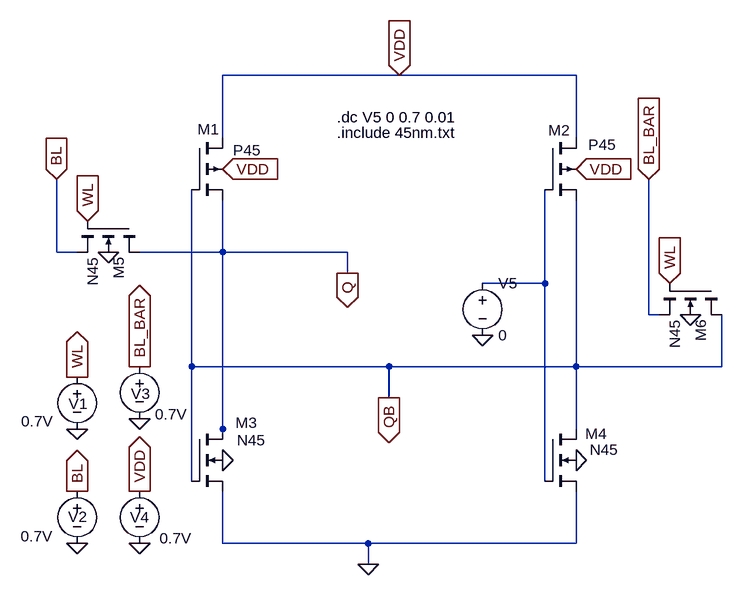
[diagram p0: schematic SNM_Test.asc]
SNM_Test.asc, the LTspice schematic file:
Version 4.1
SHEET 1 2232 956
WIRE 480 -32 208 -32
WIRE 752 -32 480 -32
WIRE 208 64 208 -32
WIRE 752 64 752 -32
WIRE -48 240 -48 128
WIRE -16 240 -48 240
WIRE 208 240 208 160
WIRE 208 240 80 240
WIRE 400 240 208 240
WIRE 400 272 400 240
WIRE 704 288 704 144
WIRE 704 288 608 288
WIRE 864 336 864 128
WIRE 880 336 864 336
WIRE 160 416 160 144
WIRE 464 416 160 416
WIRE 752 416 752 160
WIRE 752 416 464 416
WIRE 976 416 976 336
WIRE 976 416 752 416
WIRE 464 464 464 416
WIRE 208 512 208 240
WIRE 752 512 752 416
WIRE 208 528 208 512
WIRE 160 592 160 416
WIRE 704 592 704 288
WIRE 208 688 208 608
WIRE 432 688 208 688
WIRE 752 688 752 608
WIRE 752 688 432 688
WIRE 432 720 432 688
FLAG -16 512 0
FLAG -16 688 0
FLAG 80 496 0
FLAG 80 688 0
FLAG -16 432 WL
IOPIN -16 432 Out
FLAG -16 608 BL
IOPIN -16 608 Out
FLAG 80 416 BL_BAR
IOPIN 80 416 Out
FLAG 80 608 VDD
IOPIN 80 608 Out
FLAG 928 336 0
FLAG 32 240 0
FLAG 432 720 0
FLAG 0 192 WL
IOPIN 0 192 In
FLAG 480 -32 VDD
IOPIN 480 -32 In
FLAG 864 128 BL_BAR
IOPIN 864 128 In
FLAG -48 128 BL
IOPIN -48 128 In
FLAG 400 272 Q
IOPIN 400 272 Out
FLAG 464 464 QB
IOPIN 464 464 Out
FLAG 608 368 0
FLAG 752 560 0
FLAG 208 560 0
FLAG 208 112 VDD
IOPIN 208 112 In
FLAG 752 112 VDD
IOPIN 752 112 In
FLAG 896 288 WL
IOPIN 896 288 In
SYMBOL voltage -16 416 R0
WINDOW 123 0 0 Left 0
WINDOW 39 0 0 Left 0
WINDOW 3 -86 84 Left 2
WINDOW 0 -13 57 Left 2
SYMATTR Value 0.7V
SYMATTR InstName V1
SYMBOL voltage -16 592 R0
WINDOW 123 0 0 Left 0
WINDOW 39 0 0 Left 0
WINDOW 0 -14 55 Left 2
WINDOW 3 -87 85 Left 2
SYMATTR InstName V2
SYMATTR Value 0.7V
SYMBOL voltage 80 400 R0
WINDOW 123 0 0 Left 0
WINDOW 39 0 0 Left 0
WINDOW 0 -13 58 Left 2
WINDOW 3 24 89 Left 2
SYMATTR InstName V3
SYMATTR Value 0.7V
SYMBOL voltage 80 592 R0
WINDOW 123 0 0 Left 0
WINDOW 39 0 0 Left 0
WINDOW 0 -15 56 Left 2
WINDOW 3 31 88 Left 2
SYMATTR InstName V4
SYMATTR Value 0.7V
SYMBOL pmos4 160 64 R0
WINDOW 0 9 -13 Left 2
WINDOW 3 64 19 Left 2
SYMATTR InstName M1
SYMATTR Value P45
SYMATTR Value2 l=45n w=120n
SYMBOL pmos4 704 64 R0
WINDOW 0 5 -12 Left 2
WINDOW 3 67 11 Left 2
SYMATTR InstName M2
SYMATTR Value P45
SYMATTR Value2 l=45n w=120n
SYMBOL nmos4 160 512 R0
WINDOW 0 68 -10 Left 2
WINDOW 3 70 17 Left 2
SYMATTR InstName M3
SYMATTR Value N45
SYMATTR Value2 l=45n w=60n
SYMBOL nmos4 704 512 R0
WINDOW 0 62 7 Left 2
WINDOW 3 69 32 Left 2
SYMATTR InstName M4
SYMATTR Value N45
SYMATTR Value2 l=45n w=60n
SYMBOL nmos4 80 192 R90
SYMATTR InstName M5
SYMATTR Value N45
SYMATTR Value2 l=45n w=90n
SYMBOL nmos4 976 288 R90
SYMATTR InstName M6
SYMATTR Value N45
SYMATTR Value2 l=45n w=90n
SYMBOL voltage 608 272 R0
SYMATTR InstName V5
SYMATTR Value 0
TEXT 384 56 Left 2 !.include 45nm.txt
TEXT 384 32 Left 2 !.dc V5 0 0.7 0.01

The netlist it stands for:
* SNM_Test.asc
V1 WL 0 0.7V
V2 BL 0 0.7V
V3 BL_BAR 0 0.7V
V4 VDD 0 0.7V
M1 VDD QB Q VDD P45 l=45n w=120n
M2 VDD N001 QB VDD P45 l=45n w=120n
M3 Q QB 0 0 N45 l=45n w=60n
M4 QB N001 0 0 N45 l=45n w=60n
M5 Q WL BL 0 N45 l=45n w=90n
M6 QB WL BL_BAR 0 N45 l=45n w=90n
V5 N001 0 0
.model NMOS NMOS
.model PMOS PMOS
.lib standard.mos
.include 45nm.txt
.dc V5 0 0.7 0.01
.backanno
.end